# EAGLE design 2relay (EAGLE 6.5.0)
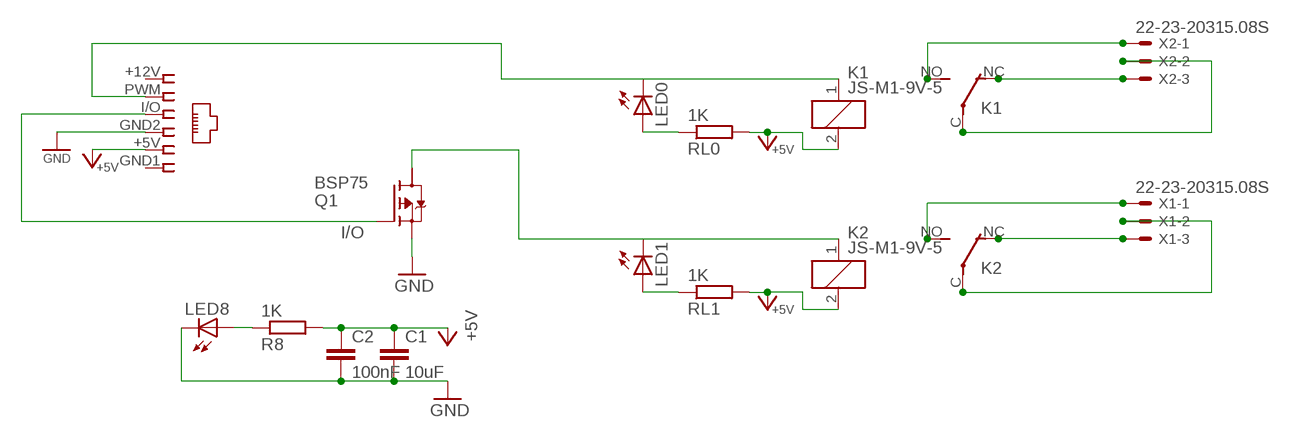
[diagram p0: schematic, sheet 1]

## Parts
C1  10uF  C-EUC1206  [C1206]
C2  100nF  C-EUC1206  [C1206]
I/O_PWM  I2C 1  RJ12STRAIGHT  [RJ12-STRAIGHT]
K1  JS-M1-9V-5  [JS-M]
K2  JS-M1-9V-5  [JS-M]
LED0  LED1206  [LED-1206]
LED1  LED1206  [LED-1206]
LED8  LED1206  [LED-1206]
Q1  BSP75  BSP613P  [PG-SOT-223]
R8  1K  R-EU_M1206  [M1206]
RL0  1K  R-EU_M1206  [M1206]
RL1  1K  R-EU_M1206  [M1206]
X1  22-23-20315.08S  [3-PIN-5.08S]
X2  22-23-20315.08S  [3-PIN-5.08S]

## Nets
+5V [highpower]: C1.1 C2.1 I/O_PWM.+5V K1.2 K2.2 R8.2 RL0.2 RL1.2
GND [highpower]: C1.2 C2.2 I/O_PWM.GND2 LED8.C Q1.3(S)
I/O: I/O_PWM.I/O Q1.1(G)
N$1 [power]: K2.1 LED1.C Q1.2(D)
N$2: LED0.A RL0.1
N$4: LED1.A RL1.1
N$5 [highpower]: K2.C(2:P) X1.2
N$6 [highpower]: K1.NC(2:O) X2.3
N$7 [highpower]: K2.NC(2:O) X1.3
N$14 [highpower]: K2.NO(2:S) X1.1
N$19 [highpower]: K1.NO(2:S) X2.1
N$23: LED8.A R8.1
POWER1 [highpower]: K1.C(2:P) X2.2
PWM [power]: I/O_PWM.PWM K1.1 LED0.C
Unconnected: I/O_PWM.+12V I/O_PWM.GND1 Q1.4(D)

## Library data of the parts
C1 C2 = rcl:C-EU: CAPACITOR, European symbol
I/O_PWM = lpatiny:RJ12: CORCOM Modular RJ Jacks No Shield Source: www.tycoelectronics.com .. ENG_DS_1654001_1099_RJ_L_0507.pdf
K1 K2 = relay:JS-M1*: Automotive Ultra-Miniature Power Relay NAiS Source: http://www.mew-europe.com/.. en_ds_61211_0000.pdf; OC_FARNELL: unknown; OC_NEWARK: unknown
LED0 LED1 LED8 = SparkFun:LED: LEDs Standard schematic elements and footprints for 5mm, 3mm, 1206, and 0603 sized LEDs. 5mm - Spark Fun Electronics SKU : COM-00529 (and others)
Q1 = infineon:BSP613P: SIPMOS (R) Small-Signal-Transistor P-Channel (2 Drain) Source: http://www.infineon.com/dgdl/BSP613P_Rev2.4.pdf; OC_FARNELL: unknown; OC_NEWARK: unknown
R8 RL0 RL1 = resistor:R-EU_: RESISTOR, European symbol
X1 X2 = lpatiny:22-23-2031: .100" (2.54mm) Center Header - 3 Pin

## Net classes
0 default: width 0.61 mm
1 power: width 0.914 mm
2 highpower: width 0.914 mm

## Board
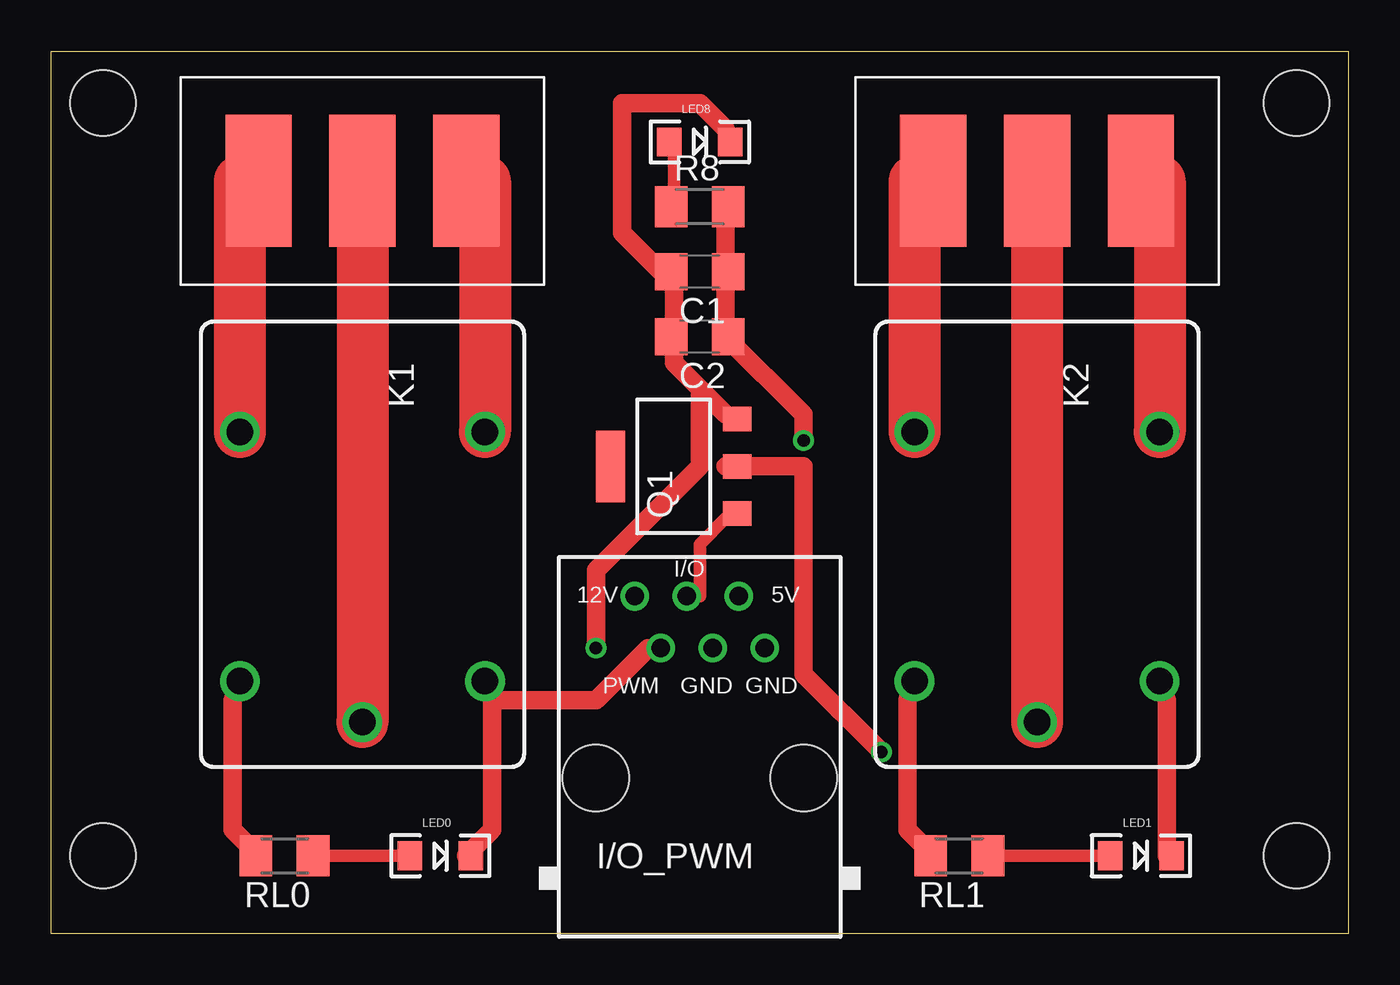
[diagram p1: board, top side]
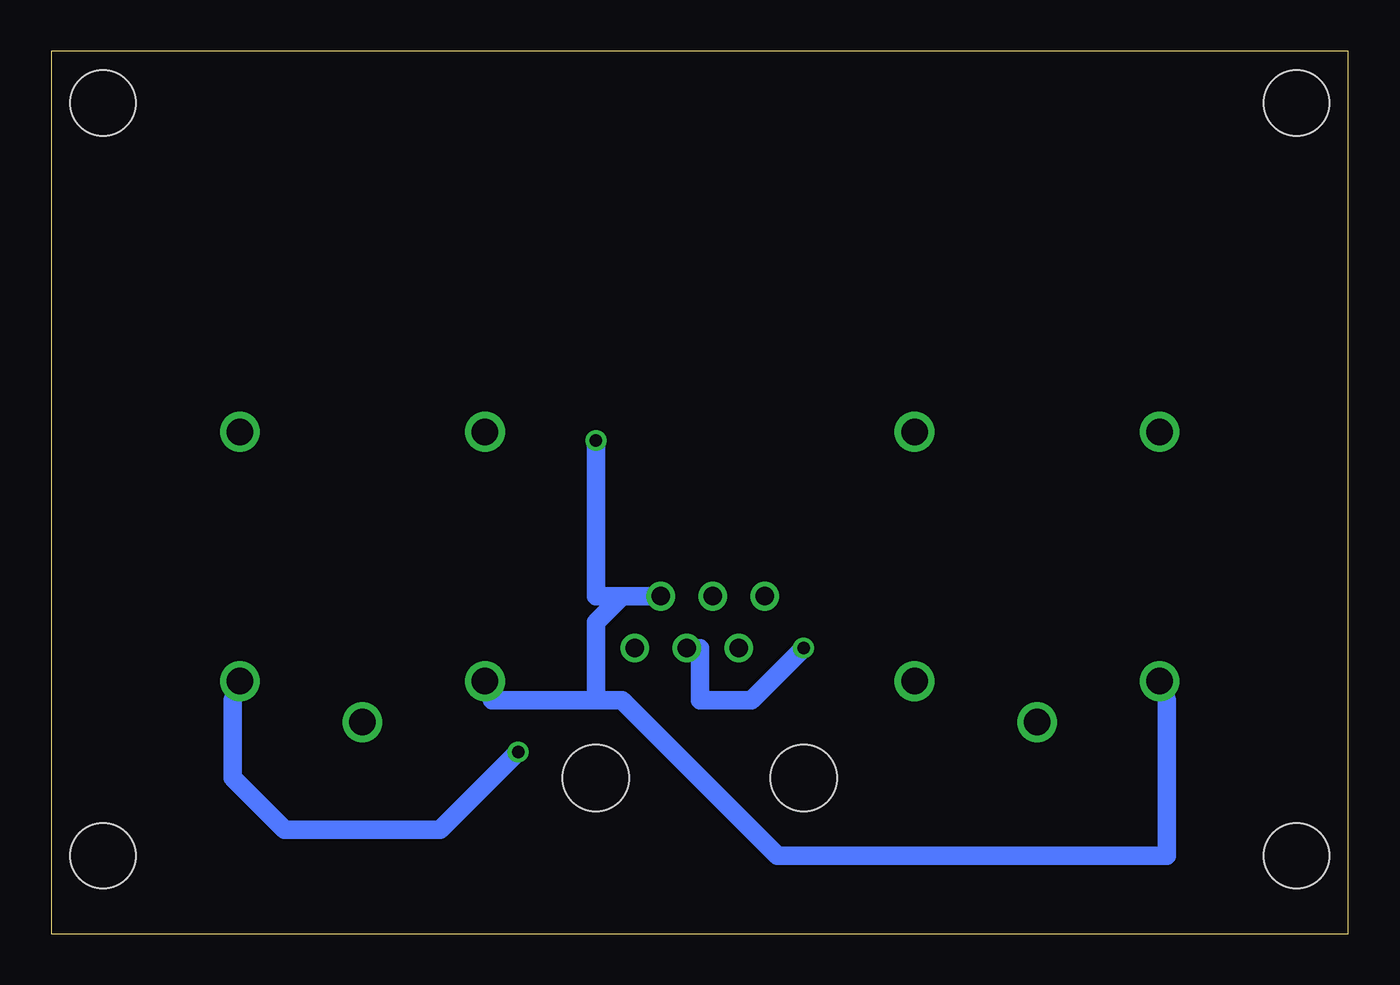
[diagram p2: board, bottom side, seen from below]

Size 63.5 x 43.18 mm. Coordinates in mm from the lower left corner, seen from the top.
Outline: 0,43.18 63.5,43.18 63.5,0 0,0 0,43.18
Copper layers (1*16): Top 0.035mm / dielectric 1.5mm / Bottom 0.035mm
Design rules "default": minimum track width 10mil, minimum drill 24mil, track to track 8mil, track to pad 8mil, pad to pad 8mil, via to via 8mil, smd to smd 8mil, copper to edge 40mil, drill to drill 8mil, minimum pad ring 10mil, minimum via ring 8mil, stop-mask expansion 4mil, vias tented up to drill 0mil, thermal gap 10mil
Holes 3.2 mm at 2.54,40.64 2.54,3.81 60.96,3.81 60.96,40.64
tRestrict: area 44.5,6.3 to 52.1,14; area 11.4,6.3 to 19.1,14; area 38.1,12.7 to 71.1,68.6; area -7.6,12.7 to 25.4,68.6
bRestrict: area 38.1,12.7 to 71.1,68.6; area 11.4,6.3 to 19.1,14; area 44.5,6.3 to 52.1,14; area -7.6,12.7 to 25.4,68.6
vRestrict: area 27.9,19.1 to 35.6,43.2
Milling: 4 lines

### Footprints (pad centres in the part's own frame; a part is rotated, then mirrored left to right if it is on the bottom)
C1206 = smd 1.6 x 1.8: 1 -1.4,0; 2 1.4,0
RJ12-STRAIGHT = drill 0.9 pad 1.4: +5V 1.905,8.89; +12V -3.175,8.89; GND1 3.175,6.35; GND2 0.635,6.35; I/O -0.635,8.89; PWM -1.905,6.35 | hole 3.251: -5.08,0; 5.08,0
JS-M = drill 1.3: 1 6.7,6; 2 6.7,-6; C 8.7,0; NC -5.5,-6; NO -5.5,6
LED-1206 = smd 1.2 x 1.4: A -1.5,0; C 1.5,0
PG-SOT-223 = smd 1.2 x 1.4: 1 -2.311,-3.099; 2 0,-3.099; 3 2.311,-3.099 | smd 3.5 x 1.4: 4 0,3.099
M1206 = smd 1.6 x 2: 1 -1.4,0; 2 1.4,0
3-PIN-5.08S = smd 3.251 x 6.452: 1 -5.08,0; 2 0,0; 3 5.08,0

### Placement (x,y rotation side)
C1  31.75,32.38 180 top
C2  31.75,29.21 180 top
I/O_PWM  31.75,7.62 0 top
K1  15.24,19.05 270 top
K2  48.26,19.05 270 top
LED0  19.05,3.81 0 top
LED1  53.34,3.81 0 top
LED8  31.75,38.73 0 top
Q1  30.48,22.86 90 top
R8  31.75,35.56 0 top
RL0  11.43,3.81 180 top
RL1  44.45,3.81 180 top
X1  48.26,36.83 180 top
X2  15.24,36.83 180 top

### Tracks (layer width: path | path; a pad name or v marks a point on that pad's centre or on a via)
+5V  (via drill 0.61)
  Top 0.914: RL0.2 10.16,3.81 8.89,5.08 8.89,11.43 K1.2 | 33.02,31.75 33.02,29.21 | 33.02,29.21 C2.1 33.02,29.21 | 33.02,31.75 C1.1 33.02,31.75 | 33.02,31.75 33.02,35.56 R8.2 | RL1.2 43.18,3.81 41.91,5.08 41.91,11.43 K2.2 | 33.02,29.21 36.83,25.4 v36.83,24.13
  Bottom 0.914: 35.56,16.51 34.29,16.51 I/O_PWM.+5V | 35.56,16.51 36.83,15.24 36.83,11.43 | 36.83,11.43 41.91,11.43 K2.2 | v36.83,24.13 36.83,16.51 35.56,16.51 | 36.83,11.43 35.56,11.43 27.94,3.81 8.89,3.81 8.89,11.43 K1.2
GND  (via drill 0.61)
  Top 0.914: 30.48,31.75 27.94,34.29 27.94,40.64 31.75,40.64 33.02,39.37 LED8.C | 30.48,31.75 C1.2 30.48,31.75 | 31.75,26.67 30.48,27.94 30.48,29.21 | 31.75,26.67 33.02,25.4 Q1.3 | 30.48,29.21 C2.2 30.48,29.21 | v26.67,13.97 26.67,17.78 31.75,22.86 31.75,26.67 | 30.48,29.21 30.48,31.75
  Bottom 0.914: v26.67,13.97 29.21,11.43 31.75,11.43 31.75,13.97 I/O_PWM.GND2
I/O
  Top 0.61: Q1.1 33.02,20.32 31.75,19.05 31.75,16.51 I/O_PWM.I/O
N$1  (via drill 0.61)
  Top 0.914: LED1.C 54.61,3.81 54.61,11.43 K2.1 | Q1.2 36.83,22.86 36.83,12.7 v40.64,8.89 | Q1.2 33.02,22.86 Q1.2
  Bottom 0.914: v40.64,8.89 44.45,5.08 52.07,5.08 54.61,7.62 54.61,11.43 K2.1
N$2
  Top 0.61: RL0.1 12.7,3.81 RL0.1 | RL0.1 LED0.A | LED0.A 17.78,3.81 LED0.A
N$4
  Top 0.61: RL1.1 45.72,3.81 RL1.1 | RL1.1 LED1.A | LED1.A 52.07,3.81 LED1.A
N$5
  Top 2.54: X1.2 K2.C
N$6
  Top 2.54: X2.3 9.24,36.83 K1.NC
N$7
  Top 2.54: X1.3 42.26,36.83 K2.NC
N$14
  Top 2.54: X1.1 54.26,36.83 K2.NO
N$19
  Top 2.54: X2.1 21.24,36.83 K1.NO
N$23
  Top 0.61: LED8.A 30.48,38.1 30.48,35.56 R8.1
POWER1
  Top 2.54: X2.2 K1.C
PWM
  Top 0.914: 21.59,11.43 21.59,5.08 20.32,3.81 LED0.C | 21.59,11.43 K1.1 21.59,11.43 | 21.59,11.43 26.67,11.43 29.21,13.97 I/O_PWM.PWM